# Altium schematic sheet Project_Information.SchDoc: =project_title
size Tabloid; CompanyName: Luxonis Holding; Organization: Luxonis Holding; Address1: 1925 Harmony Park Drive; Address2: Westminster, CO; Address3: 80234; Address4: United States; SheetNumber: 1; SheetTotal: 17
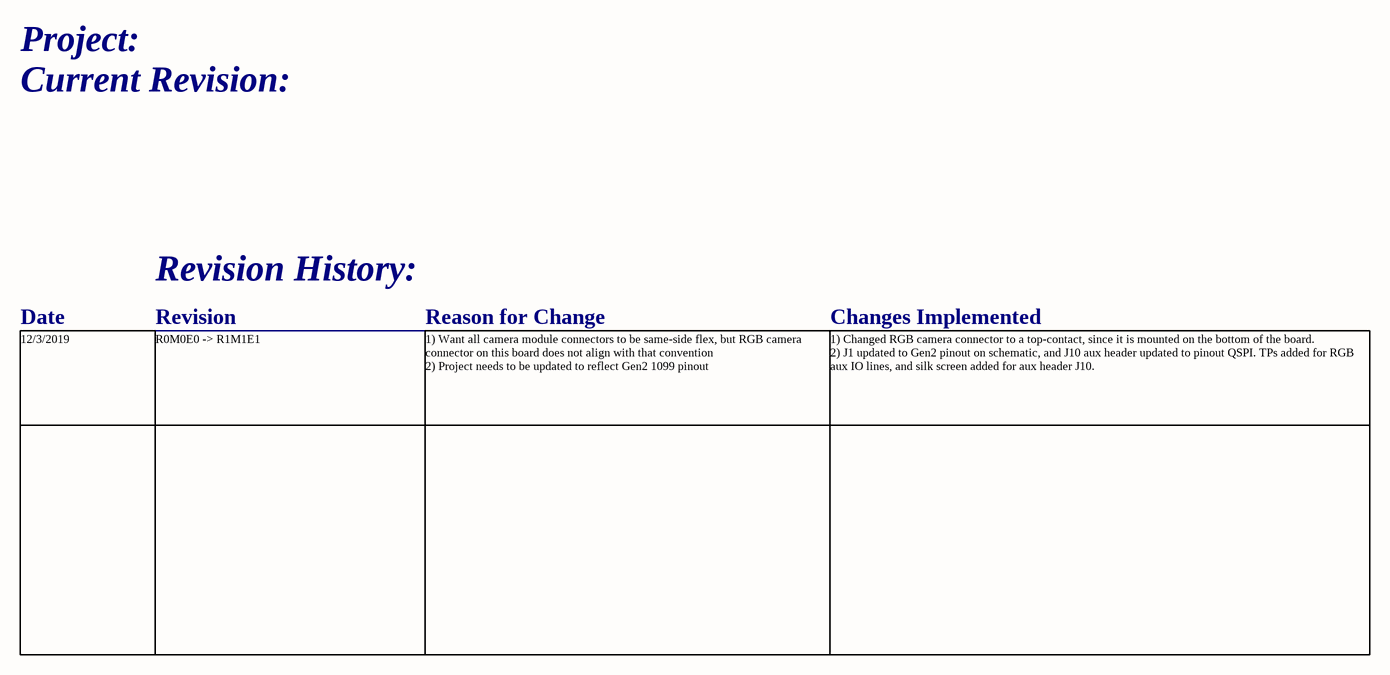
[diagram p0: Project_Information.SchDoc]

## Notes on the sheet
- Project:
- Current Revision:
- Revision History:
- Date
- Revision
- Reason for Change
- Changes Implemented
- 12/3/2019
- R0M0E0 -> R1M1E1
- 1) Want all camera module connectors to be same-side flex, but RGB camera connector on this board does not align with that convention
  2) Project needs to be updated to reflect Gen2 1099 pinout
- 1) Changed RGB camera connector to a top-contact, since it is mounted on the bottom of the board.
  2) J1 updated to Gen2 pinout on schematic, and J10 aux header updated to pinout QSPI. TPs added for RGB aux IO lines, and silk screen added for aux header J10.
- Title
- Size:
- Date:
- Tabloid
- Number:
- Time:
- Revision:
- Sheet
- of
- Drawn by: